# Altium schematic sheet ADC.SchDoc
size A
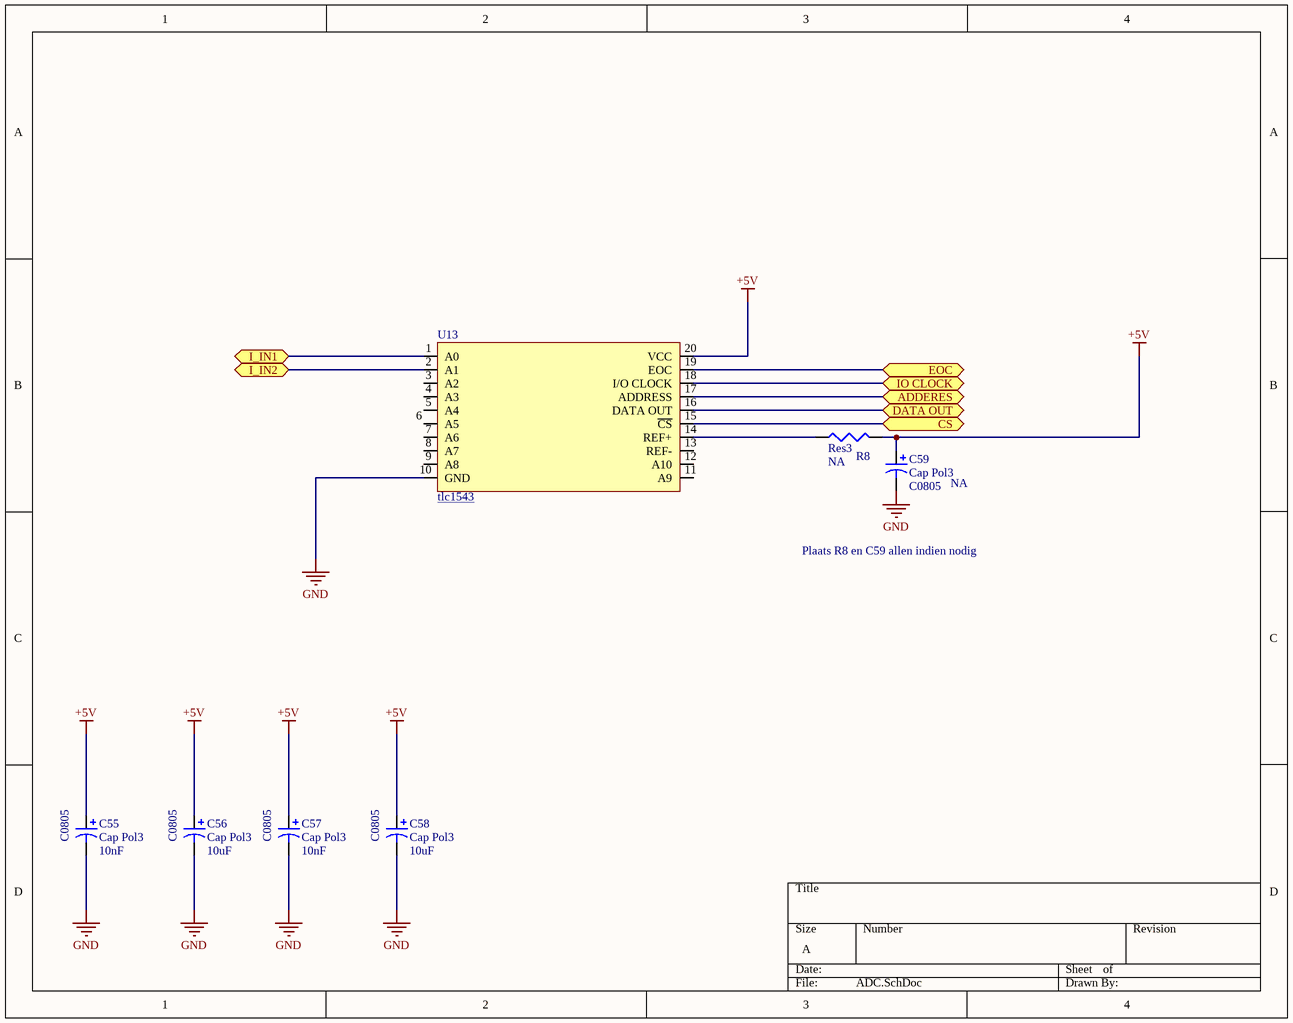
[diagram p0: ADC.SchDoc]

## Parts
C55  Cap Pol3  value 10nF  [C0805]
C56  Cap Pol3  value 10uF  [C0805]
C57  Cap Pol3  value 10nF  [C0805]
C58  Cap Pol3  value 10uF  [C0805]
C59  Cap Pol3  value NA  [C0805]
R8  Res3  value NA  [J1-0603]
U13  tlc1543  [tlc1543]

## Ports
ADDERES, CS, DATA OUT, EOC, I_IN1, I_IN2, IO CLOCK

## Nets
+5V: C55.1 C56.1 C57.1 C58.1 C59.1 R8.2 U13.20(VCC)
GND: C55.2 C56.2 C57.2 C58.2 C59.2 U13.10(GND)
ADDERES: U13.17(ADDRESS) ; port ADDERES
CS: U13.15(~{CS}) ; port CS
DATA OUT: U13.16(DATA_OUT) ; port DATA OUT
EOC: U13.19(EOC) ; port EOC
I_IN1: U13.1(A0) ; port I_IN1
I_IN2: U13.2(A1) ; port I_IN2
IO CLOCK: U13.18(I/O_CLOCK) ; port IO CLOCK
NetR8_1: R8.1 U13.14(REF+)

Not connected (* = marked no-connect by the designer): U13 3(A2) 4(A3) 5(A4) 6(A5) 7(A6) 8(A7) 9(A8) 11(A9) 12(A10) 13(REF-)

## Notes on the sheet
- Plaats R8 en C59 allen indien nodig

## Library data of the parts
C55-C59 = Cap Pol3: Polarized Capacitor (Surface Mount); Published: 8-Jun-2000; LatestRevisionDate: 29-May-2009; LatestRevisionNote: IPC-7351 Footprint Added.; PackageReference: C0805; Publisher: Altium Limited; PackageDescription: Chip Capacitor
R8 = Res3: Resistor; Published: 8-Jun-2000; LatestRevisionDate: 29-May-2009; LatestRevisionNote: IPC-7351 Footprint Added.; PackageReference: J1-0603; Publisher: Altium Limited; PackageDescription: Chip Resistor